# EAGLE schematic Arduino_MEGA_2560-Rev3-empty (EAGLE 7.5.0)
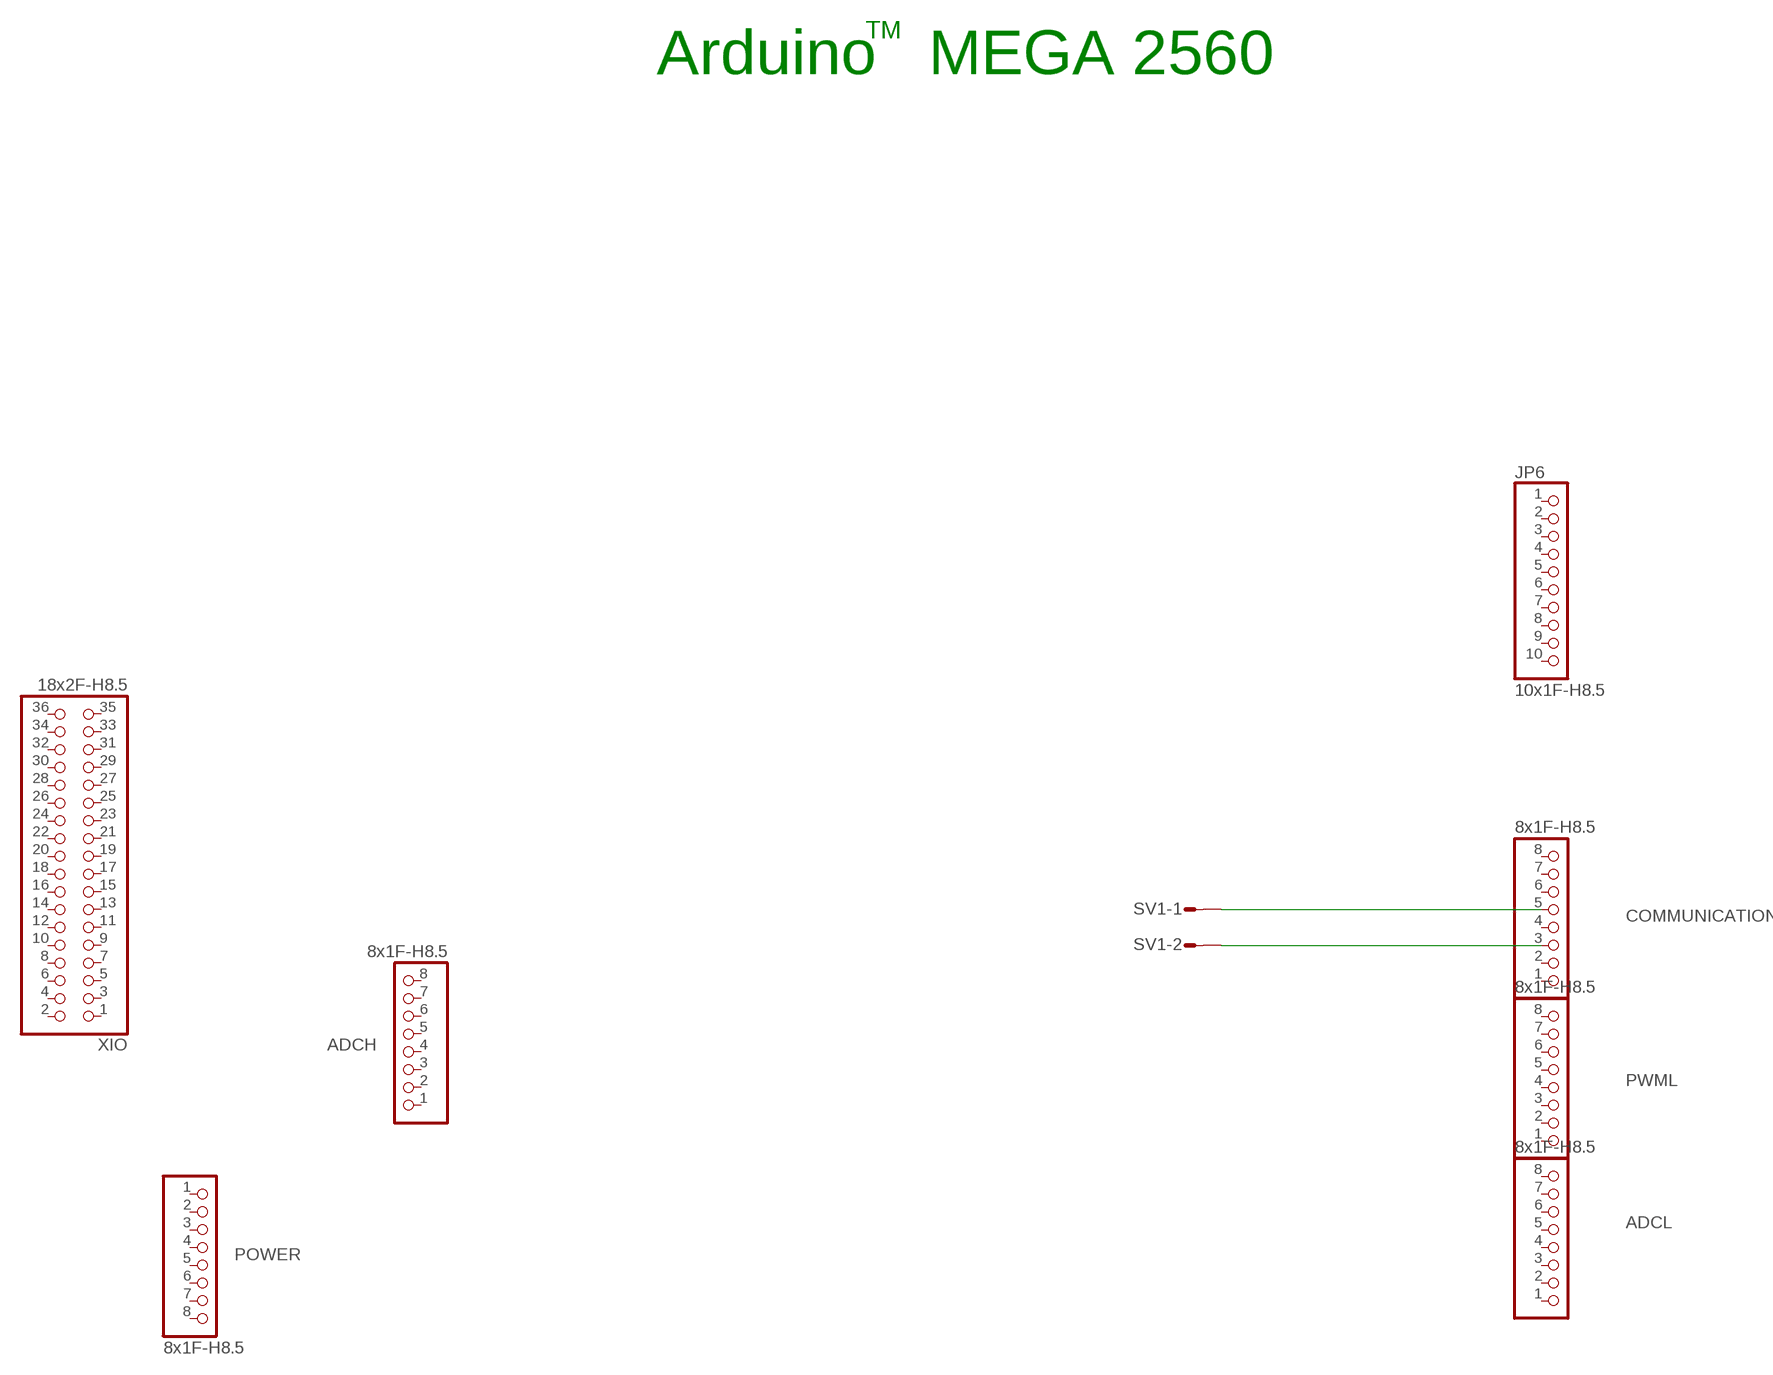
[diagram p0: schematic, sheet 1]

## Parts
ADCH  8x1F-H8.5  PINHD-1X8  [1X08]
ADCL  8x1F-H8.5  PINHD-1X8  [1X08]
COMMUNICATION  8x1F-H8.5  PINHD-1X8  [1X08]
JP6  10x1F-H8.5  PINHD-1X10_ARD  [1X10]
POWER  8x1F-H8.5  PINHD-1X8  [1X08]
PWML  8x1F-H8.5  PINHD-1X8  [1X08]
SV1  S02P  [S02P]
XIO  18x2F-H8.5  PINHD-2X18  [2X18]

## Nets
N$1: COMMUNICATION.5 SV1.1
N$2: COMMUNICATION.3 SV1.2
Unconnected: ADCH.1 ADCH.2 ADCH.3 ADCH.4 ADCH.5 ADCH.6 ADCH.7 ADCH.8 ADCL.1 ADCL.2 ADCL.3 ADCL.4 ADCL.5 ADCL.6 ADCL.7 ADCL.8 COMMUNICATION.1 COMMUNICATION.2 COMMUNICATION.4 COMMUNICATION.6 COMMUNICATION.7 COMMUNICATION.8 JP6.1 JP6.2 JP6.3 JP6.4 JP6.5 JP6.6 JP6.7 JP6.8 JP6.9 JP6.10 POWER.1 POWER.2 POWER.3 POWER.4 POWER.5 POWER.6 POWER.7 POWER.8 PWML.1 PWML.2 PWML.3 PWML.4 PWML.5 PWML.6 PWML.7 PWML.8 XIO.1 XIO.2 XIO.3 XIO.4 XIO.5 XIO.6 XIO.7 XIO.8 XIO.9 XIO.10 XIO.11 XIO.12 XIO.13 XIO.14 XIO.15 XIO.16 XIO.17 XIO.18 XIO.19 XIO.20 XIO.21 XIO.22 XIO.23 XIO.24 XIO.25 XIO.26 XIO.27 XIO.28 XIO.29 XIO.30 XIO.31 XIO.32 XIO.33 XIO.34 XIO.35 XIO.36

## Notes on the sheet
- TM
- Arduino   MEGA 2560

## Library data of the parts
ADCH ADCL COMMUNICATION POWER PWML = SmartPrj:PINHD-1X8: PIN HEADER
JP6 = SmartPrj:PINHD-1X10_ARD: PIN HEADER
SV1 = con-amp-mt:S02P: AMP MT CONNECTOR; OC_FARNELL: unknown; OC_NEWARK: unknown
XIO = SmartPrj:PINHD-2X18: PIN HEADER

## Net classes
0 default: width 0.203 mm, drill 0.406 mm, clearance 0.203 mm
1 power: width 0.61 mm, drill 0.406 mm, clearance 0.203 mm
2 gnd: width 0.305 mm, drill 0.406 mm, clearance 0.203 mm
3 power usb: width 0.508 mm, drill 0.406 mm, clearance 0.203 mm